# EAGLE design HexJacks (EAGLE 6.6.0)
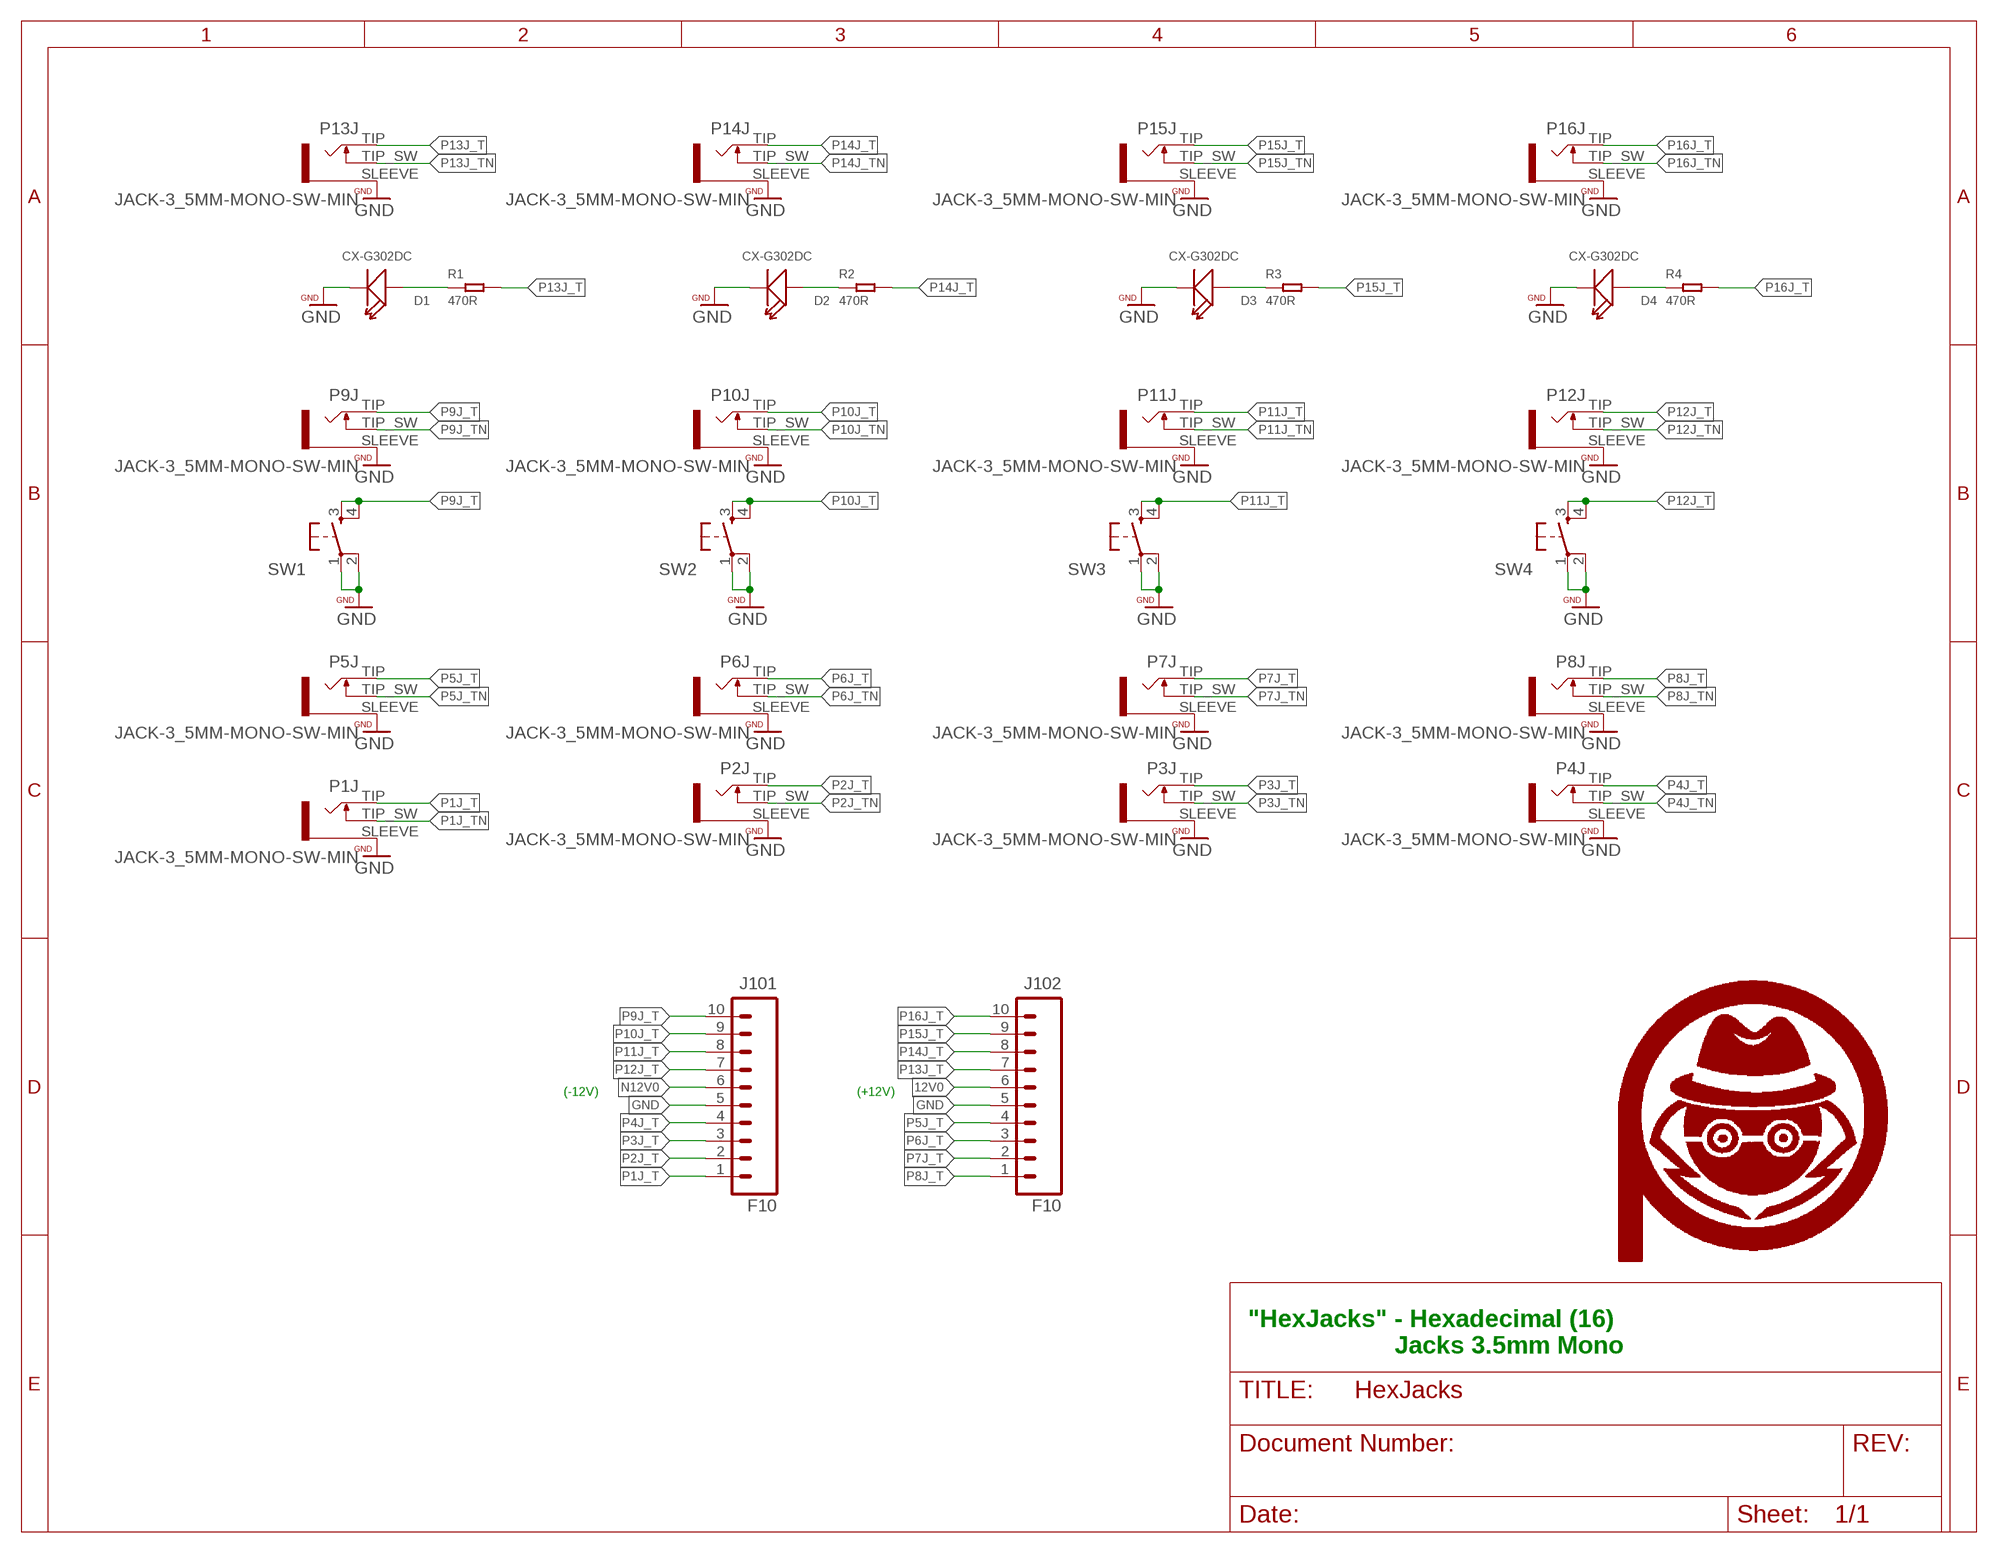
[diagram p0: schematic, sheet 1]

## Parts
D1  CX-G302DC  DIP-LED-GREEN-GREEN(2P-D3MM)  [LED2-2.54-D3.0MM]
D2  CX-G302DC  DIP-LED-GREEN-GREEN(2P-D3MM)  [LED2-2.54-D3.0MM]
D3  CX-G302DC  DIP-LED-GREEN-GREEN(2P-D3MM)  [LED2-2.54-D3.0MM]
D4  CX-G302DC  DIP-LED-GREEN-GREEN(2P-D3MM)  [LED2-2.54-D3.0MM]
J101  F10  M10SILK_FEMALE_PTH  [1X10_OCTO]
J102  F10  M10SILK_FEMALE_PTH  [1X10_OCTO]
P1J  JACK-3_5MM-MONO-SW-MIN  [WQP_PJ301M-MIN]
P2J  JACK-3_5MM-MONO-SW-MIN  [WQP_PJ301M-MIN]
P3J  JACK-3_5MM-MONO-SW-MIN  [WQP_PJ301M-MIN]
P4J  JACK-3_5MM-MONO-SW-MIN  [WQP_PJ301M-MIN]
P5J  JACK-3_5MM-MONO-SW-MIN  [WQP_PJ301M-MIN]
P6J  JACK-3_5MM-MONO-SW-MIN  [WQP_PJ301M-MIN]
P7J  JACK-3_5MM-MONO-SW-MIN  [WQP_PJ301M-MIN]
P8J  JACK-3_5MM-MONO-SW-MIN  [WQP_PJ301M-MIN]
P9J  JACK-3_5MM-MONO-SW-MIN  [WQP_PJ301M-MIN]
P10J  JACK-3_5MM-MONO-SW-MIN  [WQP_PJ301M-MIN]
P11J  JACK-3_5MM-MONO-SW-MIN  [WQP_PJ301M-MIN]
P12J  JACK-3_5MM-MONO-SW-MIN  [WQP_PJ301M-MIN]
P13J  JACK-3_5MM-MONO-SW-MIN  [WQP_PJ301M-MIN]
P14J  JACK-3_5MM-MONO-SW-MIN  [WQP_PJ301M-MIN]
P15J  JACK-3_5MM-MONO-SW-MIN  [WQP_PJ301M-MIN]
P16J  JACK-3_5MM-MONO-SW-MIN  [WQP_PJ301M-MIN]
R1  470R  SMD-RES-470R-5%-1/10W(0603)  [R0603]
R2  470R  SMD-RES-470R-5%-1/10W(0603)  [R0603]
R3  470R  SMD-RES-470R-5%-1/10W(0603)  [R0603]
R4  470R  SMD-RES-470R-5%-1/10W(0603)  [R0603]
SW1  TAC_SWITCHPTH  [TACTILE-PTH]
SW2  TAC_SWITCHPTH  [TACTILE-PTH]
SW3  TAC_SWITCHPTH  [TACTILE-PTH]
SW4  TAC_SWITCHPTH  [TACTILE-PTH]
U$25  PA_LOGO_SYMSMALL  [PA_LOGO_AGENT_SMALL_SYM]
U$26  PA_LOGO_SYMSMALL  [PA_LOGO_AGENT_SMALL_SYM]
U$27  PA_LOGO_SYMSMALL  [PA_LOGO_AGENT_SMALL_SYM]
U$28  PA_LOGO_SYMSMALL  [PA_LOGO_AGENT_SMALL_SYM]

## Nets
12V0: J102.6
GND: D1.K(-) D2.K(-) D3.K(-) D4.K(-) J101.5 J102.5 P1J.SLEEVE P2J.SLEEVE P3J.SLEEVE P4J.SLEEVE P5J.SLEEVE P6J.SLEEVE P7J.SLEEVE P8J.SLEEVE P9J.SLEEVE P10J.SLEEVE P11J.SLEEVE P12J.SLEEVE P13J.SLEEVE P14J.SLEEVE P15J.SLEEVE P16J.SLEEVE SW1.1 SW1.2 SW2.1 SW2.2 SW3.1 SW3.2 SW4.1 SW4.2
N12V0: J101.6
N$1: D1.A(+) R1.1
N$2: D2.A(+) R2.1
N$3: D3.A(+) R3.1
N$4: D4.A(+) R4.1
P1J_T: J101.1 P1J.TIP
P1J_TN: P1J.TIP_SW
P2J_T: J101.2 P2J.TIP
P2J_TN: P2J.TIP_SW
P3J_T: J101.3 P3J.TIP
P3J_TN: P3J.TIP_SW
P4J_T: J101.4 P4J.TIP
P4J_TN: P4J.TIP_SW
P5J_T: J102.4 P5J.TIP
P5J_TN: P5J.TIP_SW
P6J_T: J102.3 P6J.TIP
P6J_TN: P6J.TIP_SW
P7J_T: J102.2 P7J.TIP
P7J_TN: P7J.TIP_SW
P8J_T: J102.1 P8J.TIP
P8J_TN: P8J.TIP_SW
P9J_T: J101.10 P9J.TIP SW1.3 SW1.4
P9J_TN: P9J.TIP_SW
P10J_T: J101.9 P10J.TIP SW2.3 SW2.4
P10J_TN: P10J.TIP_SW
P11J_T: J101.8 P11J.TIP SW3.3 SW3.4
P11J_TN: P11J.TIP_SW
P12J_T: J101.7 P12J.TIP SW4.3 SW4.4
P12J_TN: P12J.TIP_SW
P13J_T: J102.7 P13J.TIP R1.2
P13J_TN: P13J.TIP_SW
P14J_T: J102.8 P14J.TIP R2.2
P14J_TN: P14J.TIP_SW
P15J_T: J102.9 P15J.TIP R3.2
P15J_TN: P15J.TIP_SW
P16J_T: J102.10 P16J.TIP R4.2
P16J_TN: P16J.TIP_SW

## Notes on the sheet
- (-12V) | (+12V)
- "HexJacks" - Hexadecimal (16) 
                       Jacks 3.5mm Mono

## Library data of the parts
D1-D4 = Seeed-LED-2016:DIP-LED-GREEN-GREEN(2P-D3MM): 304090040; MPN: CX-G302DC
J101 J102 = oXo_Connectors:M10: Header 10 Standard 10-pin 0.1" header. Use with straight break away headers (SKU : PRT-00116), right angle break away headers (PRT-00553), swiss pins (PRT-00743), machine pins (PRT-00117), and female headers (PRT-00115).; PROD_ID: CONN-11563
P1J P2J P3J P4J P5J P6J P7J P8J P9J P10J P11J P12J P13J P14J P15J P16J = halcyonmod_Connectors:JACK-3_5MM-MONO-SW: Jack, 3.5mm, RIght Angle, Though-Hole
R1-R4 = Seeed-Resistor-2016:SMD-RES-470R-5%-1/10W(0603): 301010088; MPN: RC0603JR-07470RL
SW1-SW4 = SparkFun:TAC_SWITCH: Momentary Switch Button commonly used for reset or general input. Spark Fun Electronics SKU : COM-00097
U$25-U$28 = PatternAgents-Logos:PA_LOGO_SYM: PatternAgents Logo Symbol Trademark : PatternAgents, LLC Github : https://github.com/PatternAgents/PCB_Libraries License : http://creativecommons.org/licenses/by-sa/3.0/ (Creative Commons 3.0) THIS SOFTWARE IS PROVIDED BY THE CONTRIBUTORS "AS IS" AND WITHOUT ANY EXPRESS OR IMPLIED WARRANTIES, INCLUDING, BUT NOT LIMITED TO, THE IMPLIED WARRANTIES OF MERCHANTABILITY AND FITNESS FOR A PARTICULAR PURPOSE ARE DISCLAIMED. IN NO EVENT SHALL THE COPYRIGHT OWNER OR CONTRIBUTORS BE LIABLE FOR ANY DIRECT, INDIRECT, INCIDENTAL, SPECIAL, EXEMPLARY, OR CONSEQUENTIAL DAMAGES (INCLUDING, BUT NOT LIMITED TO, PROCUREMENT OF SUBSTITUTE GOODS OR SERVICES; LOSS OF USE, DATA, OR PROFITS; OR BUSINESS INTERRUPTION) HOWEVER CAUSED AND ON ANY THEORY OF LIABILITY, WHETHER IN CONTRACT, STRICT LIABILITY, OR TORT (INCLUDING NEGLIGENCE OR OTHERWISE) ARISING IN ANY WAY OUT OF THE USE OF THIS SOFTWARE, EVEN IF ADVISED OF THE POSSIBILITY OF SUCH DAMAGE.

## Board
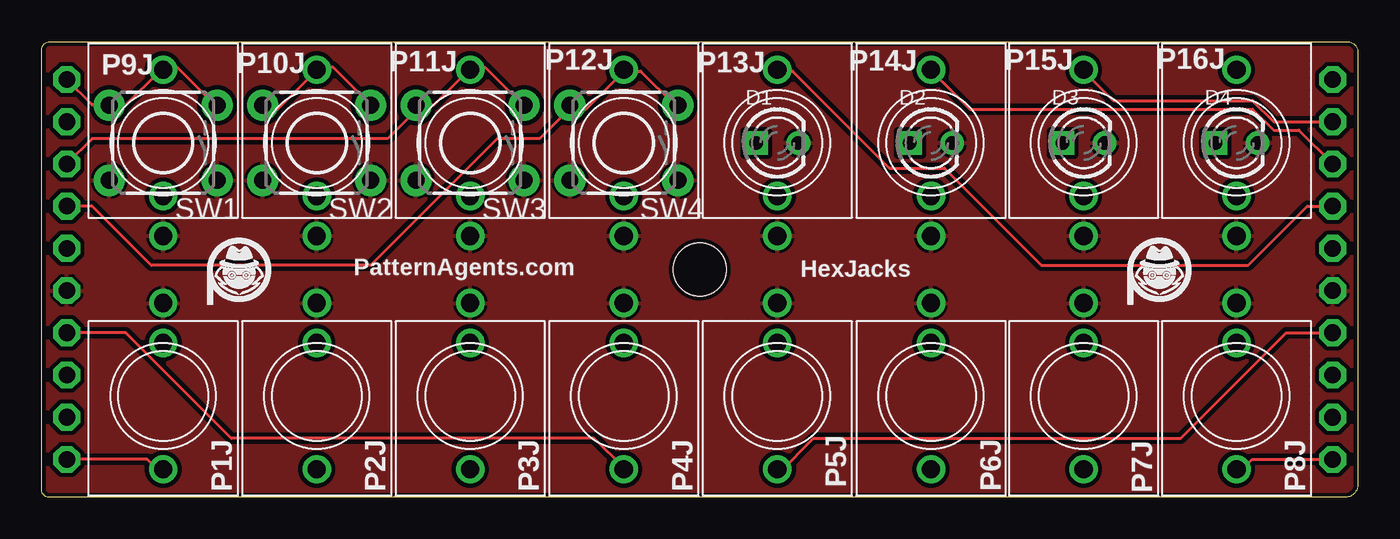
[diagram p1: board, top side]
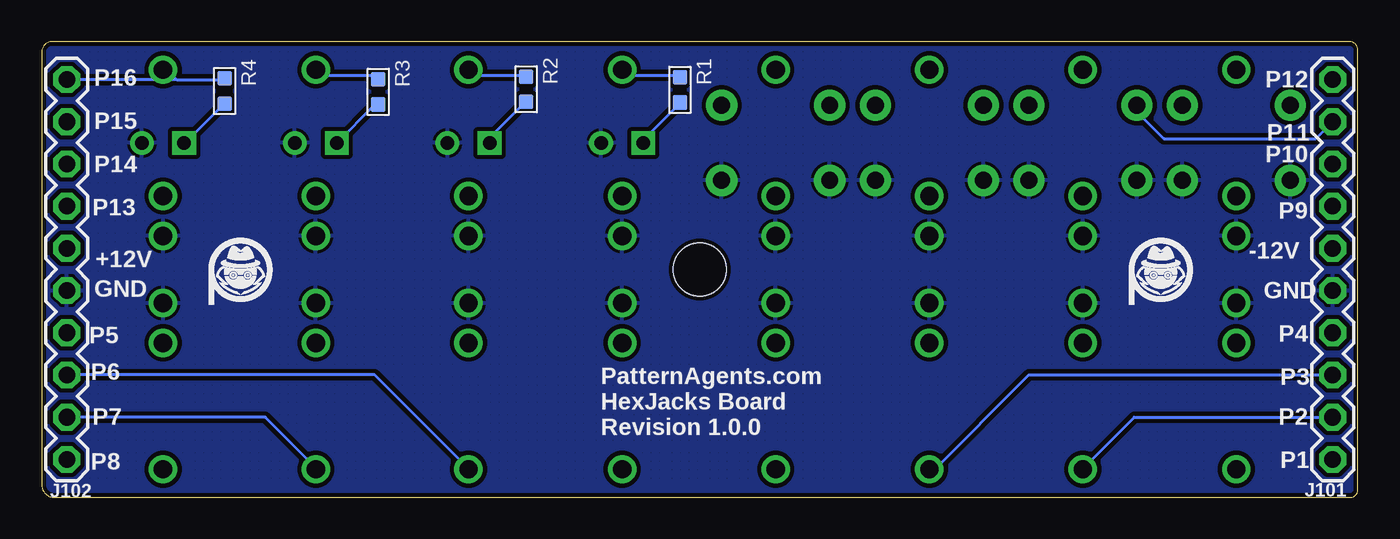
[diagram p2: board, bottom side, seen from below]

Size 79.25 x 27.43 mm. Coordinates in mm from the lower left corner, seen from the top.
Outline: 0.54,27.43 78.58,27.43 arc-90 79.25,26.76 79.25,0.79 arc-90 78.45,0 0.46,0 arc-90 0,0.46 0,26.89 arc-90 0.54,27.43
Copper layers (1*16): Top 0.035mm / dielectric 1.5mm / Bottom 0.035mm
Design rules "PatternAgents_7mil": minimum track width 7mil, minimum drill 14mil, track to track 7mil, track to pad 7mil, pad to pad 7mil, via to via 7mil, smd to smd 7mil, copper to edge 7mil, drill to drill 7mil, minimum pad ring 12mil, minimum via ring 10mil, stop-mask expansion 4mil, vias tented up to drill 25mil, thermal gap 7mil
Holes 3.2 mm at 39.62,13.72

### Footprints (pad centres in the part's own frame; a part is rotated, then mirrored left to right if it is on the bottom)
LED2-2.54-D3.0MM = drill 0.813 square: A -1.27,0 | drill 0.813: K 1.27,0
1X10_OCTO = drill 1 octagon: 1 0,0; 2 2.54,0; 3 5.08,0; 4 7.62,0; 5 10.16,0; 6 12.7,0; 7 15.24,0; 8 17.78,0; 9 20.32,0; 10 22.86,0
WQP_PJ301M-MIN = drill 1.1: SLEEVE 0,-5.6; TIP 0,4.4; TIP_SW 0,-3.2
R0603 = smd 0.889 x 0.889: 1 0,0.762; 2 0,-0.762
TACTILE-PTH = drill 1.016 pad 1.88: 1 -3.251,2.261; 2 3.251,2.261; 3 -3.251,-2.261; 4 3.251,-2.261

### Placement (x,y rotation side)
D1  44.29,21.34 0 top
D2  53.54,21.34 0 top
D3  62.73,21.34 0 top
D4  71.93,21.34 0 top
J101  1.52,2.29 90 bottom
J102  77.72,2.29 90 bottom
P1J  7.32,6.1 180 top
P2J  16.56,6.1 180 top
P3J  25.8,6.1 180 top
P4J  35.05,6.1 180 top
P5J  44.29,6.1 180 top
P6J  53.54,6.1 180 top
P7J  62.73,6.1 180 top
P8J  71.93,6.1 180 top
P9J  7.32,21.34 0 top
P10J  16.56,21.34 0 top
P11J  25.8,21.34 0 top
P12J  35.05,21.34 0 top
P13J  44.29,21.34 0 top
P14J  53.54,21.34 0 top
P15J  62.73,21.34 0 top
P16J  71.93,21.34 0 top
R1  40.82,24.52 180 bottom
R2  50.08,24.56 180 bottom
R3  58.98,24.41 180 bottom
R4  68.23,24.45 180 bottom
SW1  7.32,21.34 180 top
SW2  16.56,21.34 180 top
SW3  25.8,21.34 180 top
SW4  35.05,21.34 180 top
U$25  11.88,13.35 0 bottom
U$26  67.28,13.35 0 top
U$27  11.88,13.35 0 top
U$28  67.28,13.35 0 bottom

### Tracks (layer width: path | path; a pad name or v marks a point on that pad's centre or on a via)
GND
  pour Bottom (isolate 0.254, hatched): 0,0 0,27.43 79.25,27.43 79.25,0
  pour Top (isolate 0.254, hatched): 0,0 0,27.43 79.25,27.43 79.25,0
N$1
  Bottom 0.178: R1.1 40.89,23.62 43.18,21.34 D1.A
N$2
  Bottom 0.178: R2.1 50.29,23.62 52.07,21.84 52.07,21.34 D2.A
N$3
  Bottom 0.178: R3.1 59.18,23.62 D3.A
N$4
  Bottom 0.178: R4.1 68.33,23.62 70.61,21.34 D4.A
P1J_T
  Top 0.178: J101.1 6.35,2.29 7.11,1.52 P1J.TIP
P2J_T
  Bottom 0.178: J101.2 13.46,4.83 16.51,1.78 P2J.TIP
P3J_T
  Bottom 0.178: J101.3 19.81,7.37 25.65,1.52 P3J.TIP
P4J_T
  Top 0.178: J101.4 5.08,9.91 11.43,3.56 33.27,3.56 35.05,1.78 P4J.TIP
P5J_T
  Top 0.178: J102.4 74.93,9.91 68.58,3.56 46.48,3.56 44.45,1.52 P5J.TIP
P6J_T
  Bottom 0.178: J102.3 59.18,7.37 53.59,1.78 P6J.TIP
P7J_T
  Bottom 0.178: J102.2 65.79,4.83 62.74,1.78 P7J.TIP
P8J_T
  Top 0.178: J102.1 72.9,2.29 72.14,1.52 P8J.TIP
P9J_T
  Top 0.178: J101.10 3.05,23.62 4.06,23.62 SW1.4 4.32,23.62 5.08,23.62 7.11,25.65 P9J.TIP 7.37,25.91 8.13,25.91 10.41,23.62 SW1.3
P10J_T
  Top 0.178: SW2.4 13.46,23.37 14.22,23.37 16.51,25.65 P10J.TIP 16.76,25.91 17.53,25.91 19.81,23.62 SW2.3
  Bottom 0.178: J101.9 2.54,21.59 11.68,21.59 13.46,23.37 SW2.4
P11J_T
  Top 0.178: J101.8 3.05,21.59 20.83,21.59 22.61,23.37 SW3.4 22.61,23.62 23.62,23.62 25.65,25.65 P11J.TIP 25.91,25.91 26.67,25.91 28.96,23.62 SW3.3
P12J_T
  Top 0.178: J101.7 3.05,17.53 6.6,13.97 19.81,13.97 27.43,21.59 29.97,21.59 31.75,23.37 SW4.4 32,23.37 32.77,23.37 35.05,25.65 P12J.TIP 35.31,25.65 36.07,25.65 38.1,23.62 SW4.3
P13J_T
  Top 0.178: J102.7 76.2,17.53 72.64,13.97 60.2,13.97 54.36,19.81 51.05,19.81 45.21,25.65 44.45,25.65 P13J.TIP
  Bottom 0.178: R1.2 40.89,25.4 43.94,25.4 44.2,25.65 P13J.TIP
P14J_T
  Top 0.178: J102.8 75.69,22.1 74.17,22.1 72.9,23.37 55.88,23.37 53.59,25.65 P14J.TIP
  Bottom 0.178: R2.2 50.29,25.4 53.09,25.4 53.34,25.65 P14J.TIP
P15J_T
  Top 0.178: J102.9 74.17,22.61 72.9,23.88 64.52,23.88 62.74,25.65 P15J.TIP
  Bottom 0.178: R3.2 59.18,25.4 62.23,25.4 62.48,25.65 P15J.TIP
P16J_T
  Bottom 0.178: 71.12,25.15 68.33,25.15 R4.2 | 71.12,25.15 71.88,25.91 P16J.TIP | 71.12,25.15 J102.10

### Text on the board
tPlace: PatternAgents.com | HexJacks
bPlace: P12 | P16 | P11 | P15 | P10 | P14 | P9 | P13 | -12V | +12V | GND | GND | P4 | P5 | P3 | P6 | P2 | P7 | PatternAgents.com / HexJacks Board / Revision 1.0.0 | P1 | P8